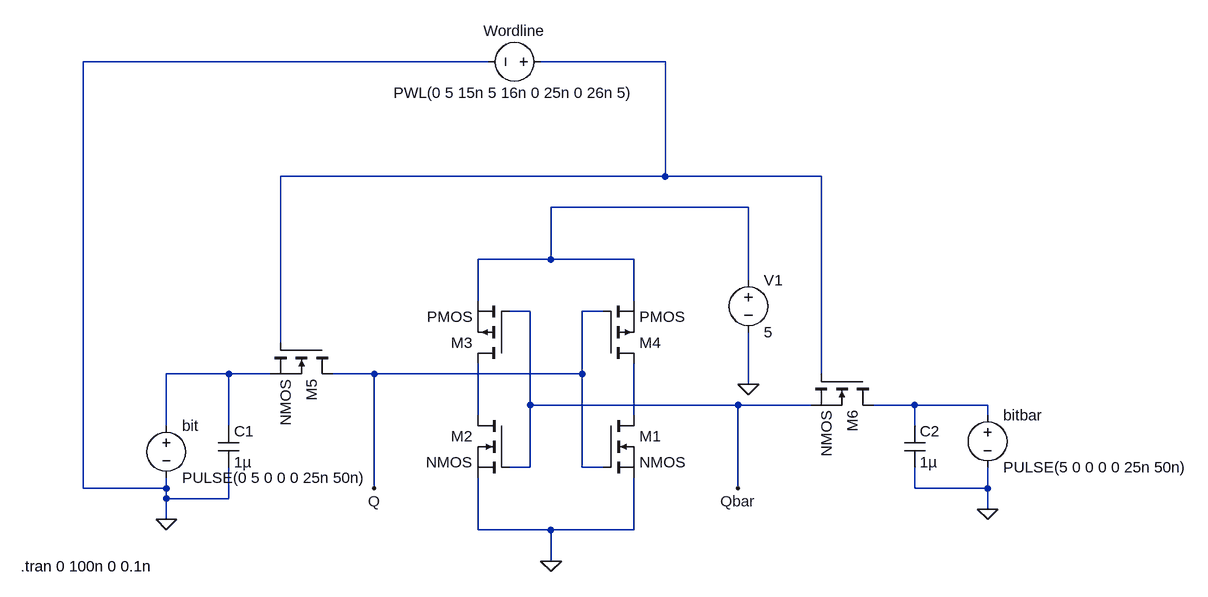
[diagram p0: schematic SRAM 6T.asc]
SRAM 6T.asc, the LTspice schematic file:
Version 4
SHEET 1 1292 680
WIRE 176 -352 -448 -352
WIRE 448 -352 256 -352
WIRE 448 -176 448 -352
WIRE 448 -176 -144 -176
WIRE 688 -176 448 -176
WIRE 576 -128 272 -128
WIRE 272 -48 272 -128
WIRE 272 -48 160 -48
WIRE 400 -48 272 -48
WIRE 576 -16 576 -128
WIRE 160 16 160 -48
WIRE 400 16 400 -48
WIRE 240 32 208 32
WIRE 352 32 320 32
WIRE -144 80 -144 -176
WIRE -224 128 -320 128
WIRE -160 128 -224 128
WIRE 0 128 -64 128
WIRE 320 128 320 32
WIRE 320 128 0 128
WIRE 688 128 688 -176
WIRE 576 144 576 64
WIRE 240 176 240 32
WIRE 560 176 240 176
WIRE 672 176 560 176
WIRE 832 176 768 176
WIRE 944 176 832 176
WIRE 160 192 160 112
WIRE 400 192 400 112
WIRE 944 192 944 176
WIRE -320 208 -320 128
WIRE -224 208 -224 128
WIRE 832 208 832 176
WIRE 240 272 240 176
WIRE 240 272 208 272
WIRE 320 272 320 128
WIRE 352 272 320 272
WIRE -448 304 -448 -352
WIRE -320 304 -320 288
WIRE -320 304 -448 304
WIRE 0 304 0 128
WIRE 560 304 560 176
WIRE 832 304 832 272
WIRE 944 304 944 272
WIRE 944 304 832 304
WIRE -320 320 -320 304
WIRE -224 320 -224 272
WIRE -224 320 -320 320
WIRE 944 336 944 304
WIRE -320 352 -320 320
WIRE 160 368 160 288
WIRE 272 368 160 368
WIRE 400 368 400 288
WIRE 400 368 272 368
WIRE 272 416 272 368
FLAG 272 416 0
FLAG 576 144 0
FLAG -320 352 0
FLAG 944 336 0
FLAG 0 304 Q
FLAG 560 304 Qbar
SYMBOL nmos 352 192 R0
SYMATTR InstName M1
SYMBOL nmos 208 192 M0
SYMATTR InstName M2
SYMBOL pmos 208 112 R180
SYMATTR InstName M3
SYMBOL pmos 352 112 M180
SYMATTR InstName M4
SYMBOL voltage 576 -32 R0
WINDOW 123 0 0 Left 2
WINDOW 39 0 0 Left 2
SYMATTR InstName V1
SYMATTR Value 5
SYMBOL nmos -64 80 R90
SYMATTR InstName M5
SYMBOL nmos 768 128 R90
SYMATTR InstName M6
SYMBOL cap -240 208 R0
SYMATTR InstName C1
SYMATTR Value 1µ
SYMBOL cap 816 208 R0
SYMATTR InstName C2
SYMATTR Value 1µ
SYMBOL voltage 944 176 R0
WINDOW 123 0 0 Left 2
WINDOW 39 0 0 Left 2
SYMATTR InstName bitbar
SYMATTR Value PULSE(5 0 0 0 0 25n 50n)
SYMBOL voltage -320 192 R0
WINDOW 123 0 0 Left 2
WINDOW 39 0 0 Left 2
SYMATTR InstName bit
SYMATTR Value PULSE(0 5 0 0 0 25n 50n)
SYMBOL voltage 272 -352 R90
WINDOW 0 -32 56 VBottom 2
WINDOW 3 32 56 VTop 2
WINDOW 123 0 0 Left 2
WINDOW 39 0 0 Left 2
SYMATTR InstName Wordline
SYMATTR Value PWL(0 5 15n 5 16n 0 25n 0 26n 5)
TEXT -544 424 Left 2 !.tran 0 100n 0 0.1n

The netlist it stands for:
* SRAM 6T.asc
M1 N006 Q 0 0 NMOS
M2 N005 Qbar 0 0 NMOS
M3 N005 Qbar N002 N002 PMOS
M4 N006 Q N002 N002 PMOS
V1 N002 0 5
M5 Q N001 N003 N003 NMOS
M6 N004 N001 Qbar Qbar NMOS
C1 N003 0 1µ
C2 N004 0 1µ
V§bitbar N004 0 PULSE(5 0 0 0 0 25n 50n)
V§bit N003 0 PULSE(0 5 0 0 0 25n 50n)
V§Wordline N001 0 PWL(0 5 15n 5 16n 0 25n 0 26n 5)
.model NMOS NMOS
.model PMOS PMOS
.lib standard.mos
.tran 0 100n 0 0.1n
.backanno
.end

* Results of the author's LTspice run, read from the files saved beside the schematic
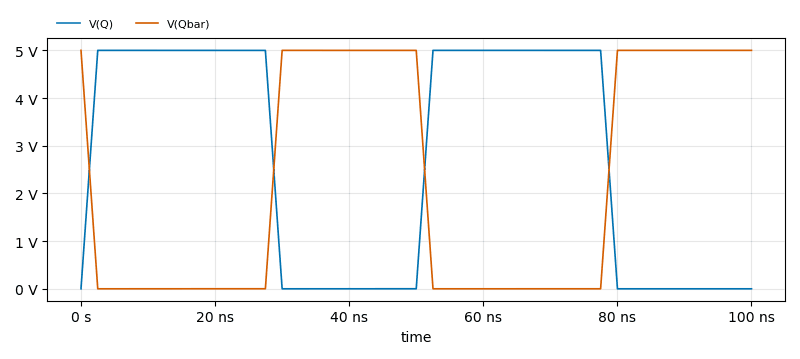
[diagram p1: Transient Analysis of SRAM 6T.asc, plotted from the saved traces]
* Transient Analysis, 1 run:
*   V(Q): min 0 V, max 5 V, average 2.75 V, rms 3.652 V, last 0 V
*   V(Qbar): min 0 V, max 5 V, average 2.25 V, rms 3.291 V, last 5 V